# EAGLE design iSensor (EAGLE 5.10)

## Sheet 1 of 2
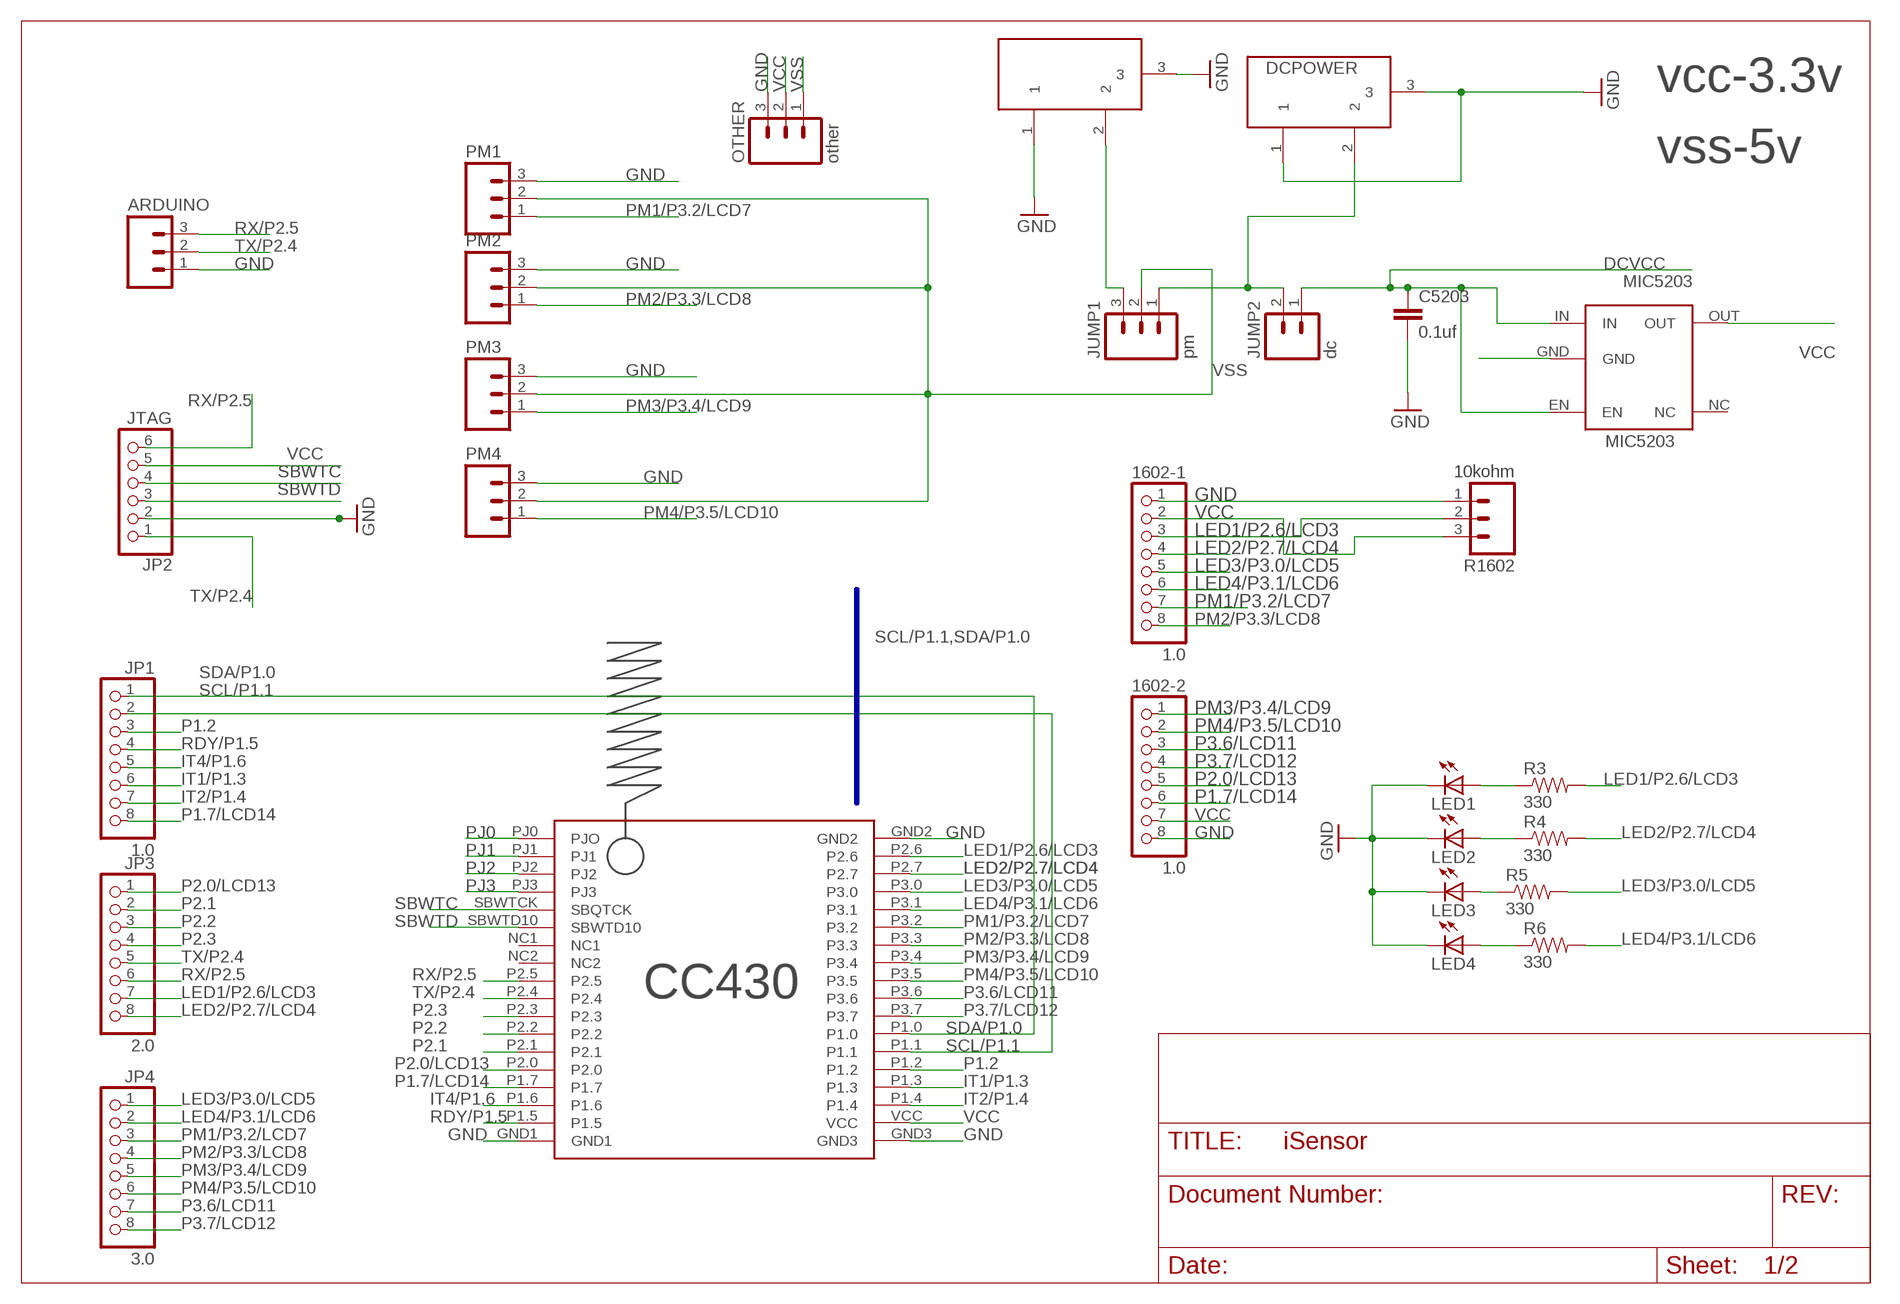
[diagram p0: schematic, sheet 1]

### Parts
1602-1  1.0  PINHEAD_PINHD-1X8  [PINHEAD_1X08]
1602-2  1.0  PINHEAD_PINHD-1X8  [PINHEAD_1X08]
ARDUINO  M03PTH  [1X03]
C5203  0.1uf  SPARKFUN_CAP1210  [SPARKFUN_1210]
DCPOWER  dcpower  POWERSUPPLY_DC21MMX  [POWERSUPPLY_DC-21MM]
JP1  1.0  PINHEAD_PINHD-1X8  [PINHEAD_1X08]
JP2  JTAG  PINHEAD_PINHD-1X6  [PINHEAD_1X06]
JP3  2.0  PINHEAD_PINHD-1X8  [PINHEAD_1X08]
JP4  3.0  PINHEAD_PINHD-1X8  [PINHEAD_1X08]
JUMP1  pm  M03LOCK  [1X03_LOCK]
JUMP2  dc  M02NG  [1X02]
LED1  SPARKFUN_LED5MM  [SPARKFUN_LED5MM]
LED2  SPARKFUN_LED5MM  [SPARKFUN_LED5MM]
LED3  SPARKFUN_LED5MM  [SPARKFUN_LED5MM]
LED4  SPARKFUN_LED5MM  [SPARKFUN_LED5MM]
MIC5203  MIC5203  RT8008  [RT8008]
OTHER  other  M03LOCK  [1X03_LOCK]
PM1  M03PTH  [1X03]
PM2  M03PTH  [1X03]
PM3  M03PTH  [1X03]
PM4  M03PTH  [1X03]
PMPOWER  pmpower  POWERSUPPLY_DC21MMX  [POWERSUPPLY_DC-21MM]
R3  330  SPARKFUN_RESISTOR  [SPARKFUN_0805]
R4  330  SPARKFUN_RESISTOR  [SPARKFUN_0805]
R5  330  SPARKFUN_RESISTOR  [SPARKFUN_0805]
R6  330  SPARKFUN_RESISTOR  [SPARKFUN_0805]
R1602  10kohm  M03LOCK  [1X03_LOCK]
U$1  CC430  [CC430]

### Nets
DCVCC: C5203.1 JUMP2.1 MIC5203.EN MIC5203.IN
GND: 1602-1.1 1602-2.8 ARDUINO.1 C5203.2 DCPOWER.1 DCPOWER.3 JP2.2 LED1.K(C) LED2.K(C) LED3.K(C) LED4.K(C) MIC5203.GND OTHER.3 PM1.3 PM2.3 PM3.3 PM4.3 PMPOWER.1 PMPOWER.3 R1602.1 U$1.GND1 U$1.GND2 U$1.GND3 ; also sheet 2
IT1/P1.3: JP1.6 U$1.P1.3 ; also sheet 2
IT2/P1.4: JP1.7 U$1.P1.4
IT4/P1.6: JP1.5 U$1.P1.6
LED1/P2.6/LCD3: 1602-1.3 JP3.7 R3.2 R1602.2 U$1.P2.6
LED2/P2.7/LCD4: 1602-1.4 JP3.8 R4.2 U$1.P2.7
LED3/P3.0/LCD5: 1602-1.5 JP4.1 R5.2 U$1.P3.0
LED4/P3.1/LCD6: 1602-1.6 JP4.2 R6.2 U$1.P3.1
N$1: DCPOWER.2 JUMP1.1 JUMP2.2
N$2: LED1.A R3.1
N$3: LED3.A R5.1
N$4: LED2.A R4.1
N$5: LED4.A R6.1
N$6: JUMP1.3 PMPOWER.2
P1.2: JP1.3 U$1.P1.2 ; also sheet 2
P1.7/LCD14: 1602-2.6 JP1.8 U$1.P1.7
P2.0/LCD13: 1602-2.5 JP3.1 U$1.P2.0
P2.1: JP3.2 U$1.P2.1 ; also sheet 2
P2.2: JP3.3 U$1.P2.2
P2.3: JP3.4 U$1.P2.3
P3.6/LCD11: 1602-2.3 JP4.7 U$1.P3.6
P3.7/LCD12: 1602-2.4 JP4.8 U$1.P3.7
PJ0: U$1.PJ0(PJO) ; also sheet 2
PJ1: U$1.PJ1 ; also sheet 2
PJ2: U$1.PJ2 ; also sheet 2
PJ3: U$1.PJ3 ; also sheet 2
PM1/P3.2/LCD7: 1602-1.7 JP4.3 PM1.1 U$1.P3.2
PM2/P3.3/LCD8: 1602-1.8 JP4.4 PM2.1 U$1.P3.3
PM3/P3.4/LCD9: 1602-2.1 JP4.5 PM3.1 U$1.P3.4
PM4/P3.5/LCD10: 1602-2.2 JP4.6 PM4.1 U$1.P3.5
RDY/P1.5: JP1.4 U$1.P1.5 ; also sheet 2
RX/P2.5: ARDUINO.3 JP2.6 JP3.6 U$1.P2.5
SBWTC: JP2.4 U$1.SBWTCK(SBQTCK)
SBWTD: JP2.3 U$1.SBWTD10
SCL/P1.1: JP1.2 U$1.P1.1 ; also sheet 2
SDA/P1.0: JP1.1 U$1.P1.0 ; also sheet 2
TX/P2.4: ARDUINO.2 JP2.1 JP3.5 U$1.P2.4
VCC: 1602-1.2 1602-2.7 JP2.5 MIC5203.OUT OTHER.2 R1602.3 U$1.VCC ; also sheet 2
VSS: JUMP1.2 OTHER.1 PM1.2 PM2.2 PM3.2 PM4.2
Unconnected: MIC5203.NC U$1.NC1 U$1.NC2

### Buses
SCL/P1.1,SDA/P1.0

### Notes on the sheet
- DCPOWER
- vcc-3.3v
- vss-5v

## Sheet 2 of 2
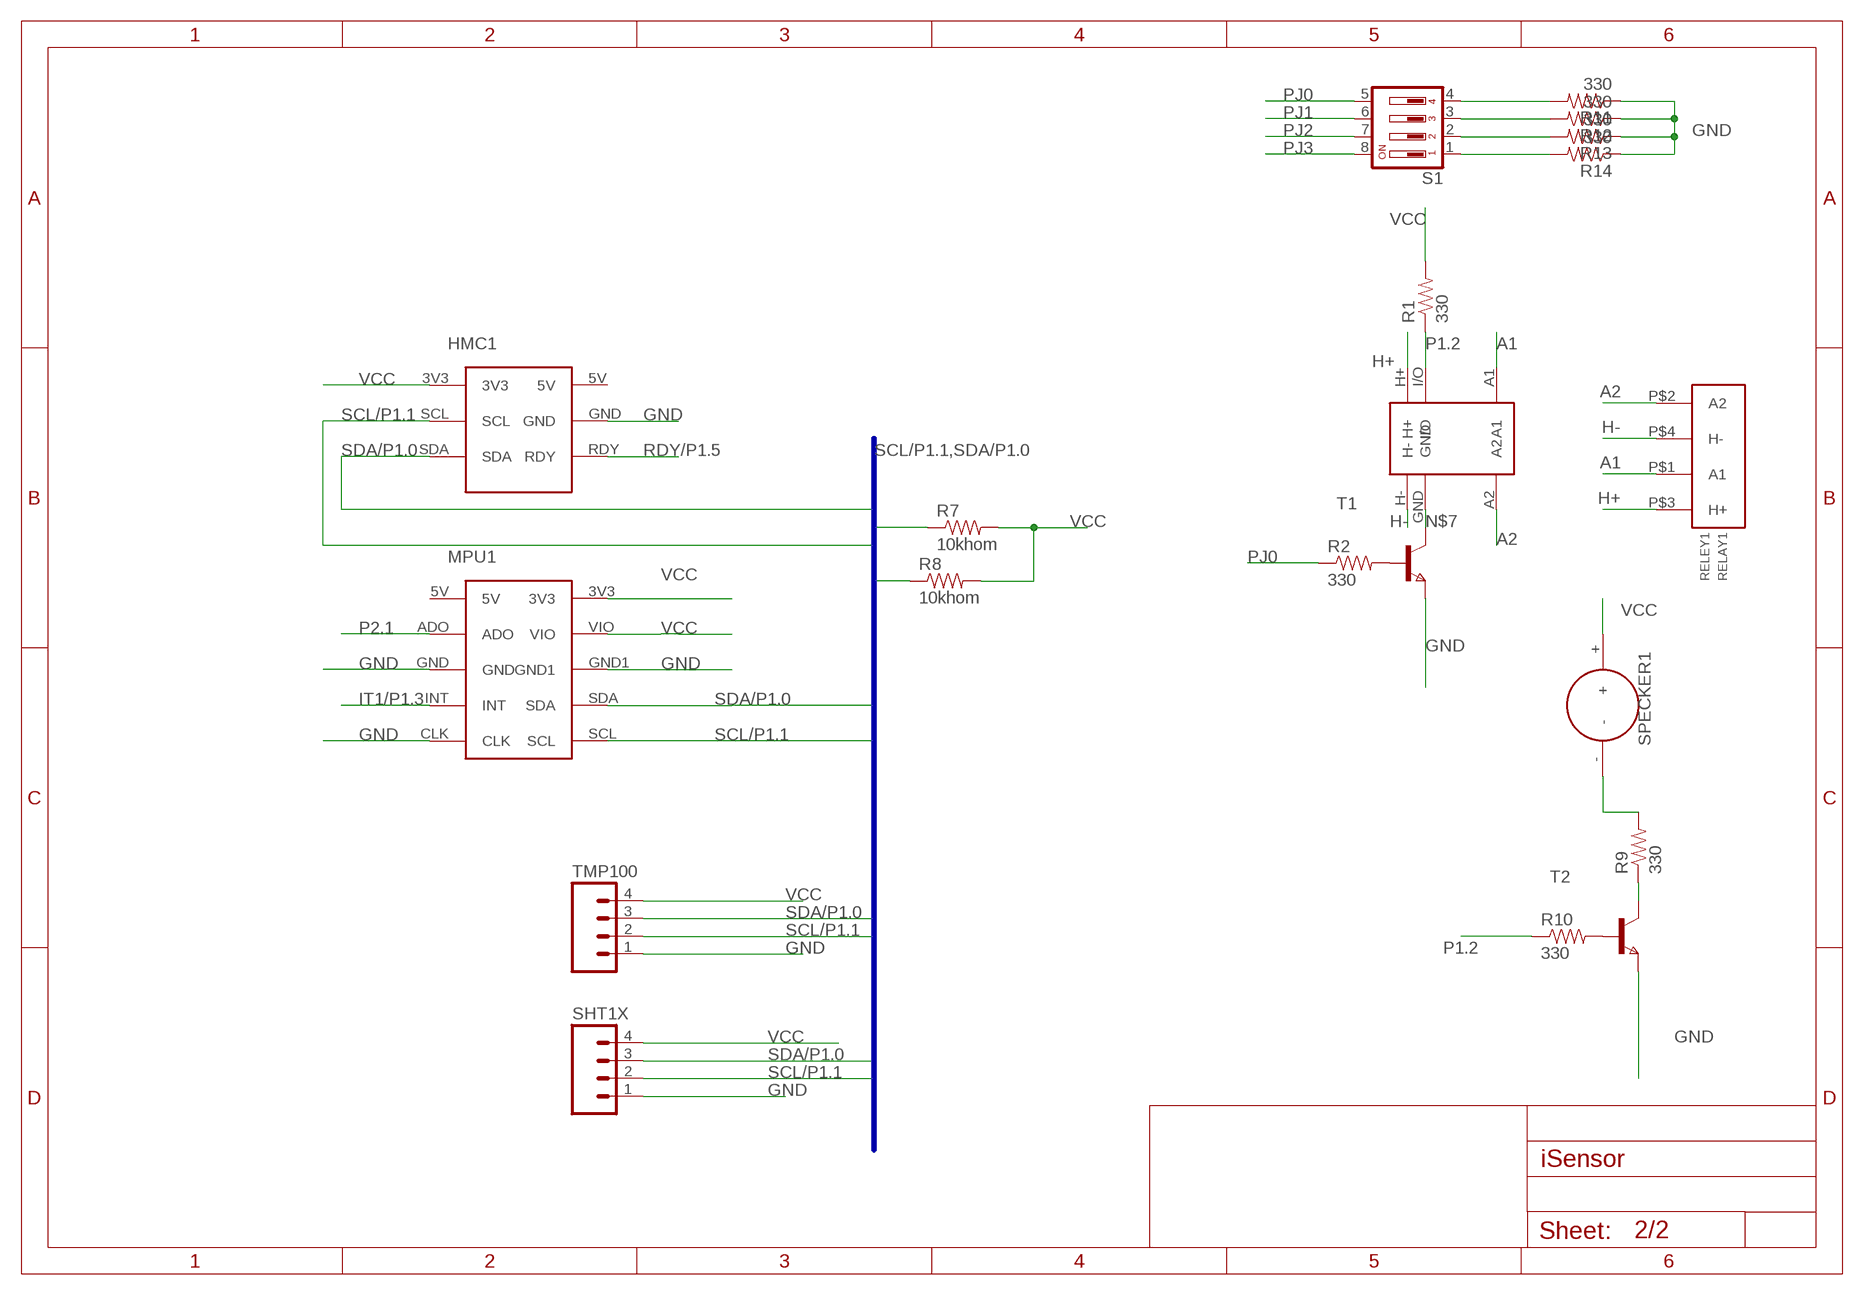
[diagram p1: schematic, sheet 2]

### Parts
HMC1  LSM303DLRHMC5883  [LSM303DLR]
MPU1  LSM303DLRMPU6050  [LSM303DLR]
R1  330  SPARKFUN_RESISTOR  [SPARKFUN_0805]
R2  330  SPARKFUN_RESISTOR  [SPARKFUN_0805]
R7  10khom  SPARKFUN_RESISTOR  [SPARKFUN_0805]
R8  10khom  SPARKFUN_RESISTOR  [SPARKFUN_0805]
R9  330  SPARKFUN_RESISTOR  [SPARKFUN_0805]
R10  330  SPARKFUN_RESISTOR  [SPARKFUN_0805]
R11  330  SPARKFUN_RESISTOR  [SPARKFUN_0805]
R12  330  SPARKFUN_RESISTOR  [SPARKFUN_0805]
R13  330  SPARKFUN_RESISTOR  [SPARKFUN_0805]
R14  330  SPARKFUN_RESISTOR  [SPARKFUN_0805]
RELER2  HRS1H-S-DC5V  [HRS1H-S-DC5V]
RELEY1  RELAY1  [RELAY1]
S1  DIP04YL  [DIP04YL]
SHT1X  SPARKFUN_M05  [SPARKFUN_1X05]
SPECKER1  SPECKER  [SPECKER]
T1  NPNSOT23  [SOT-23]
T2  NPNSOT23  [SOT-23]
TMP100  SPARKFUN_M05  [SPARKFUN_1X05]

### Nets
A1: RELER2.A1 RELEY1.P$1(A1)
A2: RELER2.A2 RELEY1.P$2(A2)
GND: HMC1.GND MPU1.CLK MPU1.GND MPU1.GND1 R11.1 R12.1 R13.1 R14.1 SHT1X.1 T1.2(E) T2.2(E) TMP100.1 ; also sheet 1
H+: RELER2.H+ RELEY1.P$3(H+)
H-: RELER2.H- RELEY1.P$4(H-)
IT1/P1.3: MPU1.INT ; also sheet 1
N$7: RELER2.GND T1.1(C)
N$8: R9.1 T2.1(C)
N$9: R2.2 T1.3(B)
N$10: R10.2 T2.3(B)
N$11: R9.2 SPECKER1.-
N$12: R11.2 S1.4
N$13: R12.2 S1.3
N$14: R13.2 S1.2
N$15: R14.2 S1.1
P1.2: R1.1 R10.1 RELER2.I/O ; also sheet 1
P2.1: MPU1.ADO ; also sheet 1
PJ0: R2.1 S1.5 ; also sheet 1
PJ1: S1.6 ; also sheet 1
PJ2: S1.7 ; also sheet 1
PJ3: S1.8 ; also sheet 1
RDY/P1.5: HMC1.RDY ; also sheet 1
SCL/P1.1: HMC1.SCL MPU1.SCL R7.1 SHT1X.2 TMP100.2 ; also sheet 1
SDA/P1.0: HMC1.SDA MPU1.SDA R8.1 SHT1X.3 TMP100.3 ; also sheet 1
VCC: HMC1.3V3 MPU1.3V3 MPU1.VIO R1.2 R7.2 R8.2 SHT1X.4 SPECKER1.+ TMP100.4 ; also sheet 1
Unconnected: HMC1.5V MPU1.5V

### Buses
SCL/P1.1,SDA/P1.0

## Library data of the parts
1602-1 1602-2 JP1 JP3 JP4 = arduno:PINHEAD_PINHD-1X8: PIN HEADER
ARDUINO JUMP1 OTHER PM1-PM4 R1602 = SparkFun:M03: Header 3 Standard 3-pin 0.1" header. Use with straight break away headers (SKU : PRT-00116), right angle break away headers (PRT-00553), swiss pins (PRT-00743), machine pins (PRT-00117), and female headers (PRT-00115). Molex polarized connector foot print use with SKU : PRT-08232 with associated crimp pins and housings.
C5203 = LSM303_breakout_board-v12:SPARKFUN_CAP: Capacitor Standard 0603 ceramic capacitor, and 0.1" leaded capacitor.
DCPOWER PMPOWER = arduno:POWERSUPPLY_DC21MM
HMC1 = HMC5883:LSM303DLR
JP2 = arduno:PINHEAD_PINHD-1X6: PIN HEADER
JUMP2 = SparkFun:M02NG
LED1-LED4 = ft232r:SPARKFUN_LED: LEDs Standard schematic elements and footprints for 5mm, 3mm, 1206, and 0603 sized LEDs. 5mm - Spark Fun Electronics SKU : COM-00529 (and others)
MIC5203 = mic5203-3.3:RT8008
MPU1 = MPU6050:LSM303DLR
R1-R14 = i2c:SPARKFUN_RESISTOR: Resistor Basic schematic elements and footprints for 0603, 1206, and PTH 1/10th watt (small) resistors.
RELER2 = reler1:HRS1H-S-DC5V
RELEY1 = RELAY1:RELAY1
S1 = switch-dil:DIP04YL: DIL/CODE SWITCH
SHT1X TMP100 = MCP4725_v12:SPARKFUN_M05: Header 5 Standard 5-pin 0.1" header. Use with straight break away headers (SKU : PRT-00116), right angle break away headers (PRT-00553), swiss pins (PRT-00743), machine pins (PRT-00117), and female headers (PRT-00115). Molex polarized connector foot print use with SKU : PRT-08230 with associated crimp pins and housings.
SPECKER1 = SPECKER:SPECKER
T1 T2 = zetex:NPNSOT23: NPN TRANSISTOR
U$1 = cc430:CC430: cc430

## Board
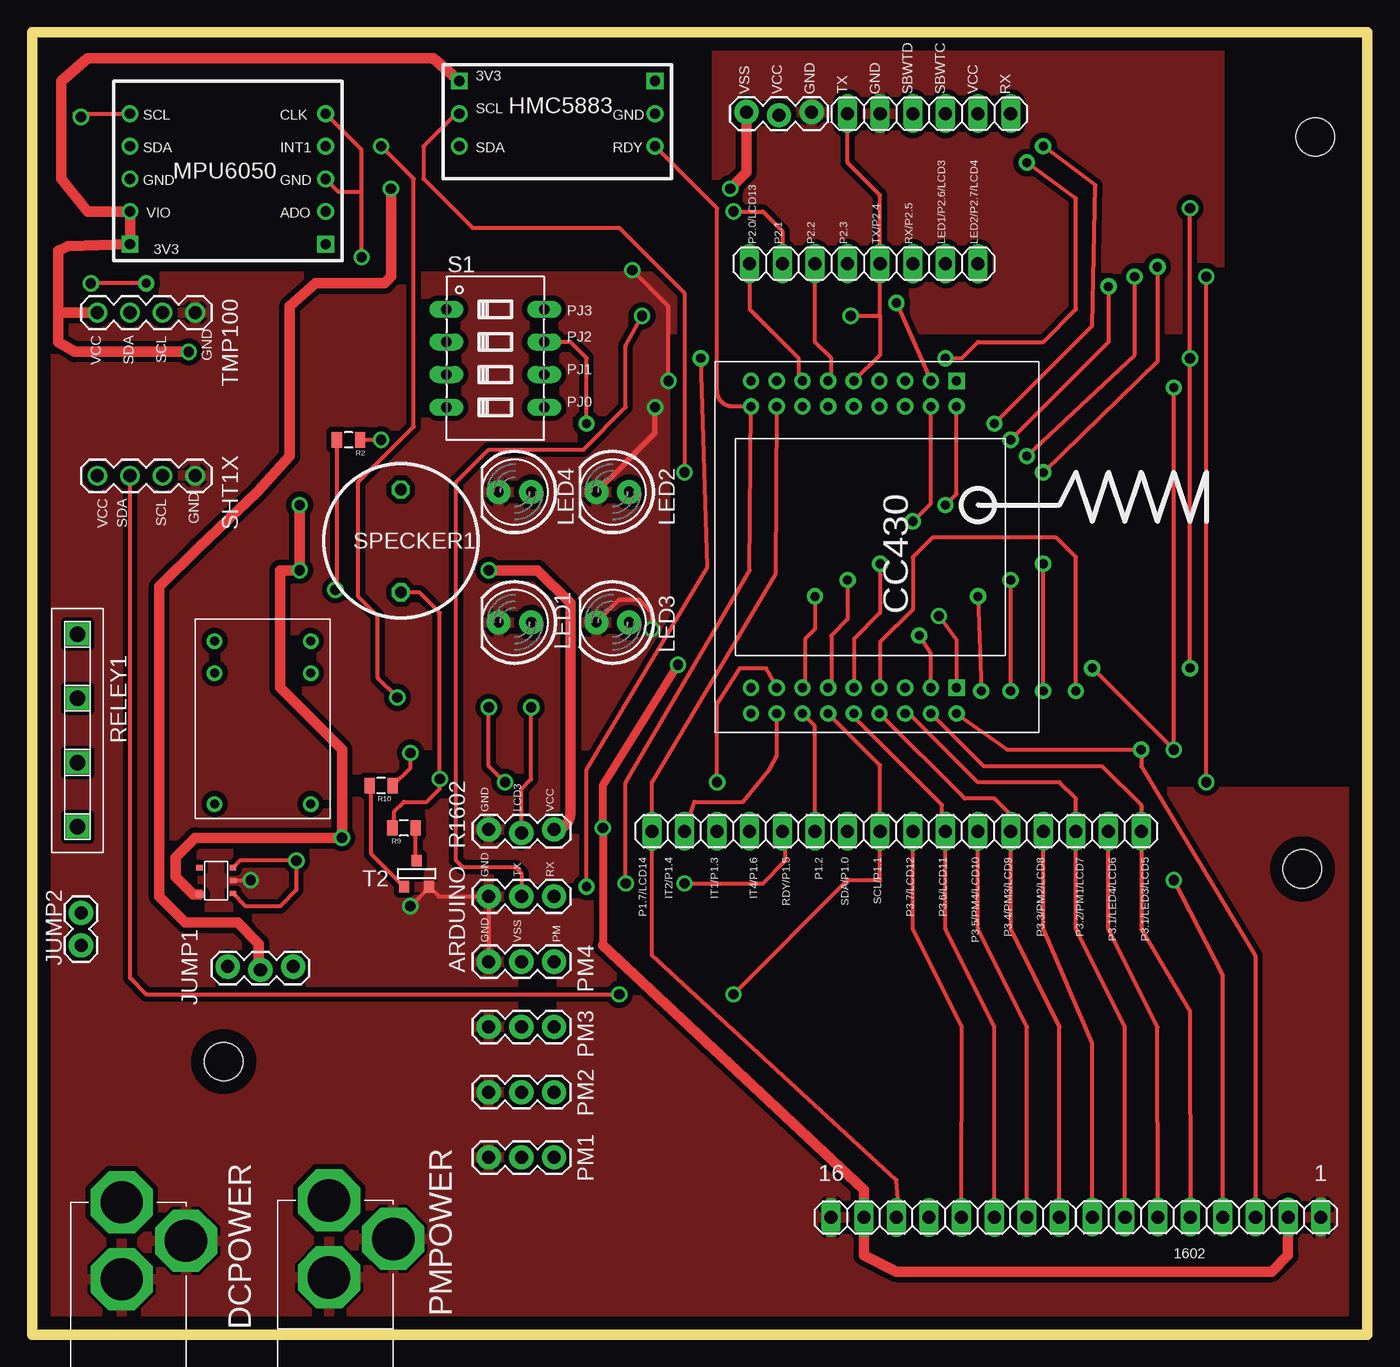
[diagram p2: board, top side]
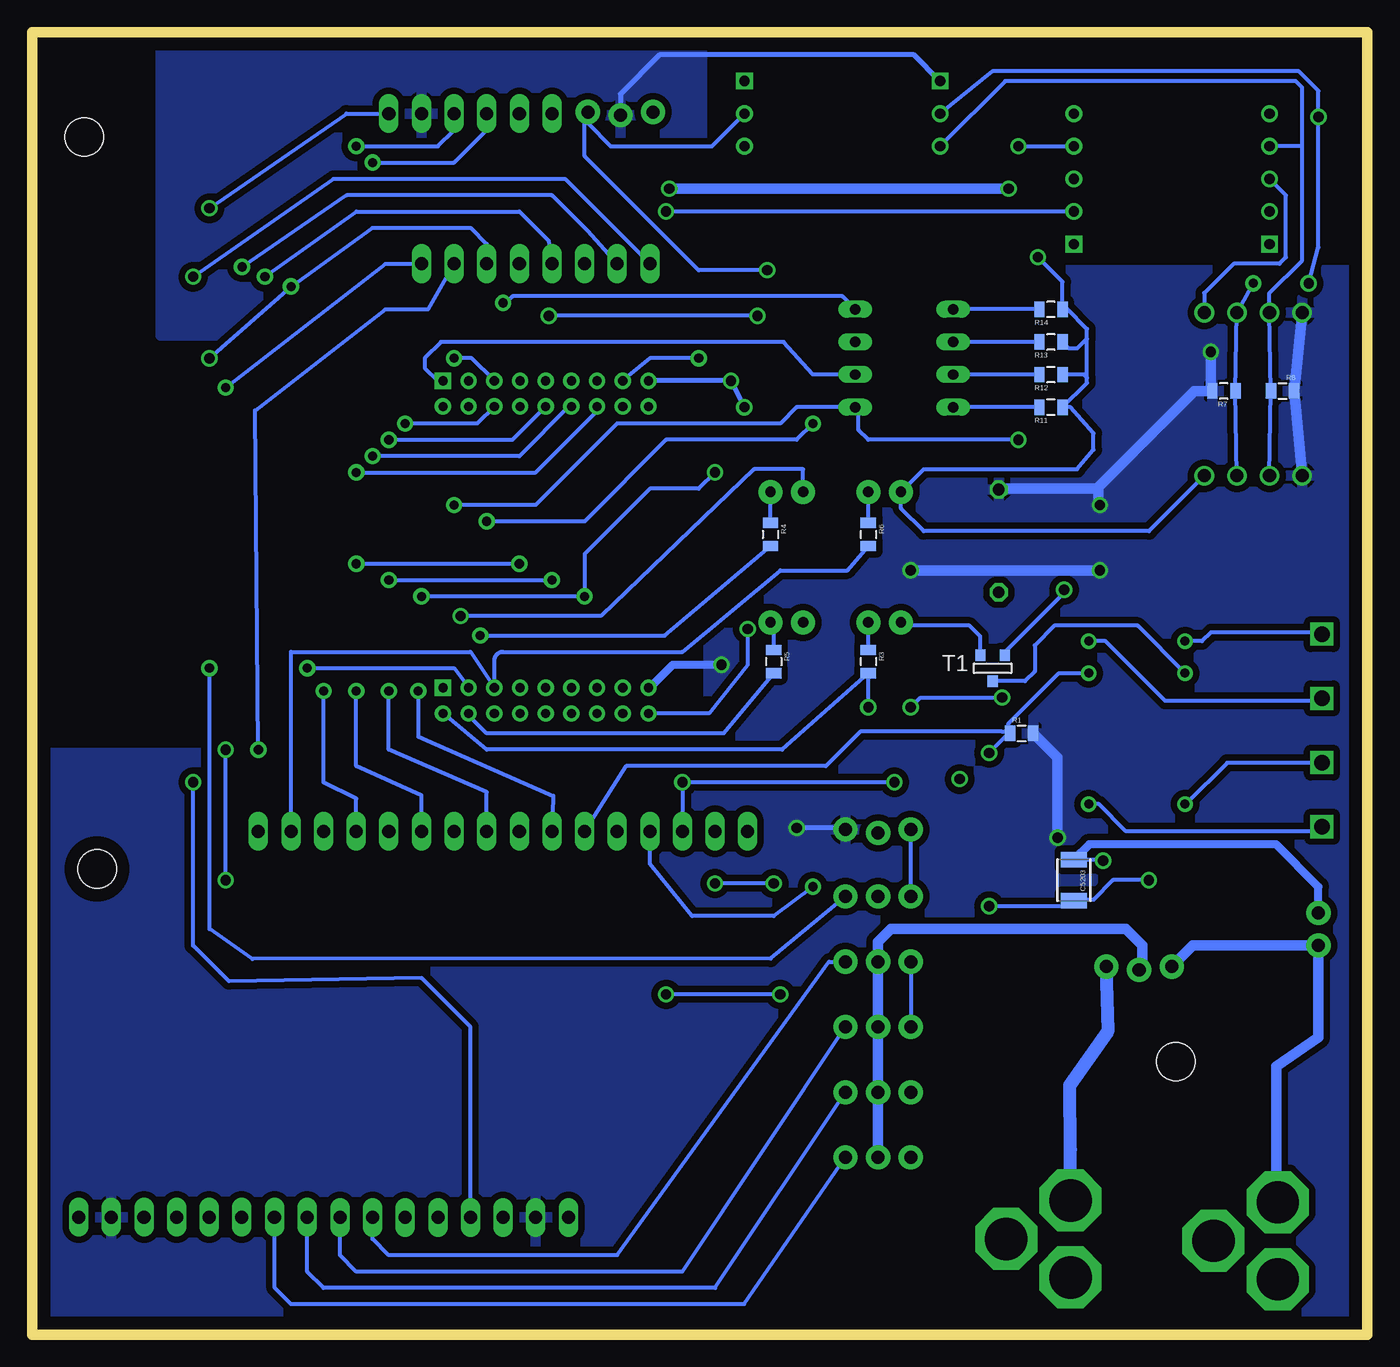
[diagram p3: board, bottom side, seen from below]

Size 103.98 x 101.44 mm. Coordinates in mm from the lower left corner, seen from the top.
Outline: 0,0 103.98,0 103.98,101.44 0,101.44 0,0
Copper layers (1*16): Top 0.035mm / dielectric 1.5mm / vcc 0.035mm
Design rules "default *": minimum track width 10mil, minimum drill 24mil, track to track 10mil, track to pad 10mil, pad to pad 10mil, via to via 10mil, smd to smd 10mil, copper to edge 40mil, drill to drill 8mil, minimum pad ring 10mil, minimum via ring 8mil, stop-mask expansion 4mil, vias tented up to drill 0mil, thermal gap 10mil
Holes 3 mm at 14.92,21.27 98.92,36.27 99.92,93.27

### Footprints (pad centres in the part's own frame; a part is rotated, then mirrored left to right if it is on the bottom)
PINHEAD_1X08 = drill 1.016 long: 1 -8.89,0; 2 -6.35,0; 3 -3.81,0; 4 -1.27,0; 5 1.27,0; 6 3.81,0; 7 6.35,0; 8 8.89,0
1X03 = drill 1.016 pad 1.88 round: 1 0,0; 2 2.54,0; 3 5.08,0
SPARKFUN_1210 = smd 1.2 x 2: 1 -1.6,0; 2 1.6,0
POWERSUPPLY_DC-21MM = drill 3.302 pad 4.826 octagon: 1 -5.08,-3.353; 2 -0.076,-6.35; 3 -0.076,-0.356
LSM303DLR = drill 0.8 pad 1.27 square: 3V3 1.27,12.7; 5V 16.51,12.7 | drill 0.8 pad 1.27 round: GND 16.51,10.16; RDY 16.51,7.62; SCL 1.27,10.16; SDA 1.27,7.62
PINHEAD_1X06 = drill 1.016 long: 1 -6.35,0; 2 -3.81,0; 3 -1.27,0; 4 1.27,0; 5 3.81,0; 6 6.35,0
1X03_LOCK = drill 1.016 pad 1.88 round: 1 0,0.127; 2 2.54,-0.127; 3 5.08,0.127
1X02 = drill 1.016 pad 1.88 round: 1 0,0; 2 2.54,0
SPARKFUN_LED5MM = drill 0.813 pad 1.88 round: A -1.27,0; K 1.27,0
RT8008 = smd 0.4 x 0.5: EN 2.5,-0.4; GND 1.5,-0.4; IN 0.5,-0.4; NC 2.5,2.2; OUT 0.4,2.2
LSM303DLR' = drill 0.8 pad 1.27 square: 3V3 16.51,12.7; 5V 1.27,12.7 | drill 0.8 pad 1.27 round: ADO 1.27,10.16; CLK 1.27,2.54; GND 1.27,7.62; GND1 16.51,7.62; INT 1.27,5.08; SCL 16.51,2.54; SDA 16.51,5.08; VIO 16.51,10.16
SPARKFUN_0805 = smd 0.8 x 1.2: 1 -0.9,0; 2 0.9,0
HRS1H-S-DC5V = drill 0.7 round: A1 14.4,9; A2 14.4,1.5; GND 4.2,1.5; H+ 1.7,9; H- 1.7,1.5; I/O 4.2,9
RELAY1 = drill 1.2 square: P$1 -6,-1; P$2 -1,-1; P$3 4,-1; P$4 9,-1
DIP04YL = drill 0.813 long: 1 -3.81,-3.81; 2 -1.27,-3.81; 3 1.27,-3.81; 4 3.81,-3.81; 5 3.81,3.81; 6 1.27,3.81; 7 -1.27,3.81; 8 -3.81,3.81
SPARKFUN_1X05 = drill 1.016 round: 1 0,0; 2 2.54,0; 3 5.08,0; 4 7.62,0
SPECKER = drill 0.9 octagon: + -4,0; - 4,0
SOT-23 = smd 0.787 x 0.889: 1 0.025,-1.016; 2 -0.94,1.016; 3 0.991,1.016
CC430 = drill 0.712 pad 1.27 round: GND1 1.5,-9.8; GND3 27.4,-9.8; NC1 1.5,0.2; NC2 3.5,0.2; P1.0 27.4,-3.8; P1.1 25.4,-5.8; P1.2 27.4,-5.8; P1.3 25.4,-7.8; P1.4 27.4,-7.8; P1.5 3.5,-9.8; P1.6 1.5,-7.8; P1.7 3.5,-7.8; P2.0 1.5,-5.8; P2.1 3.5,-5.8; P2.2 1.5,-3.8; P2.3 3.5,-3.8; P2.4 1.5,-1.8; P2.5 3.5,-1.8; P2.6 27.4,6.2; P2.7 25.4,4.2; P3.0 27.4,4.2; P3.1 25.4,2.2; P3.2 27.4,2.2; P3.3 25.4,0.2; P3.4 27.4,0.2; P3.5 25.4,-1.8; P3.6 27.4,-1.8; P3.7 25.4,-3.8; PJ0 3.5,6.2; PJ2 3.5,4.2; PJ3 1.5,4.2; SBWTCK 3.5,2.2; SBWTD10 1.5,2.2; VCC 25.4,-9.8 | drill 0.712 pad 1.27 square: GND2 25.4,6.2; PJ1 1.5,6.2

### Placement (x,y rotation side)
1602-1  91.46,9.16 180 top
1602-2  71.11,9.13 180 top
ARDUINO  35.56,34.13 0 top
C5203  22.86,35.4 270 bottom
DCPOWER  6.9,3.96 180 top
HMC1  32,84.93 0 top
JP1  57.15,39.21 180 top
JP2  69.85,95.09 0 top
JP3  64.77,83.41 0 top
JP4  77.47,39.21 180 top
JUMP1  15.24,28.54 0 top
JUMP2  3.81,32.86 270 top
LED1  37.59,55.47 180 top
LED2  45.21,65.63 180 top
LED3  45.21,55.47 180 top
LED4  37.59,65.63 180 top
MIC5203  15.24,33.88 90 top
MPU1  LSM303DLRMPU6050  [LSM303DLR']  24.13,97.63 180 top
OTHER  55.63,95.09 0 top
PM1  40.64,13.81 180 top
PM2  40.64,18.89 180 top
PM3  40.64,23.97 180 top
PM4  40.64,29.05 180 top
PMPOWER  23.05,4.11 180 top
R1  26.92,46.83 0 bottom
R2  24.64,69.69 180 top
R3  38.86,52.42 270 bottom
R4  46.48,62.32 270 bottom
R5  46.23,52.42 270 bottom
R6  38.86,62.32 270 bottom
R7  11.18,73.5 180 bottom
R8  6.6,73.5 0 bottom
R9  28.96,39.46 180 top
R10  27.18,42.77 180 top
R11  24.64,72.23 180 bottom
R12  24.64,74.77 180 bottom
R13  24.64,77.31 180 bottom
R14  24.64,79.85 180 bottom
R1602  35.56,39.21 0 top
RELER2  12.7,55.72 270 top
RELEY1  2.54,45.56 90 top
S1  36.07,76.04 270 top
SHT1X  12.7,66.9 180 top
SPECKER1  28.7,61.82 270 top
T1  29.21,51.91 0 bottom
T2  29.97,35.91 180 top
TMP100  12.7,79.6 180 top
U$1  65.79,75.79 270 top

### Tracks (layer width: path | path; a pad name or v marks a point on that pad's centre or on a via)
A1
  vcc 0.305: RELEY1.P$1 3.89,39.21 18.8,39.21 20.91,41.32 RELER2.A1
A2
  vcc 0.305: RELEY1.P$2 3.56,44.54 10.92,44.54 14.15,41.32 RELER2.A2
DCVCC  (via drill 0.8 pad 1.27)
  Top 0.305: MIC5203.EN 16.19,36.92 v20.57,36.92 20.57,34.64 19.3,33.37 16.65,33.37 MIC5203.IN
  vcc 0.305: C5203.1 20.65,37 v20.57,36.92
  vcc 0.61: JUMP2.1 3.81,34.89 7.11,38.19 21.67,38.19 C5203.1
GND  (via drill 0.8 pad 1.27)
  Top 0.305: MPU1.CLK 25.65,92.3 25.65,88.99 | v25.65,83.91 25.65,88.99 | MPU1.GND 23.88,88.99 25.65,88.99 | U$1.GND2 71.99,54.09 v70.61,55.97 | v29.46,33.37 30.91,34.82 T2.2 31.67,34.13 ARDUINO.1 PM4.3 | MIC5203.GND 16.23,35.38 v17.02,35.4 | v49.55,74.29 49.55,80.08 v46.74,82.9 | LED3.K 45.72,57.24 47.24,57.24 48.26,56.23 v48.26,54.96
  Top 0.406: LED2.K 48.51,70.2 v48.51,72.23
  vcc 0.305: v25.65,83.91 23.74,82 R14.1 23.37,79.85 21.84,78.33 21.84,77.56 | MPU1.GND1 6.35,88.74 6.35,83.91 6.86,83.41 10.41,83.41 12.7,81.12 TMP100.1 | v70.61,55.97 59.69,55.97 47.75,67.4 43.94,67.4 LED2.K | U$1.GND3 51.28,48.39 48.26,52.16 v48.26,54.96 | v29.46,33.37 23.29,33.37 C5203.2 22.78,33.88 21.34,33.88 19.81,35.4 v17.02,35.4 | T1.2 30.15,54.37 30.99,55.21 36.07,55.21 LED1.K | v46.74,82.9 52.07,82.9 60.96,91.79 60.96,94.96 OTHER.3 60.71,94.33 58.93,92.55 51.05,92.55 HMC1.GND | PM4.3 PM3.3 | 21.84,74.52 21.84,77.56 | 21.84,77.56 22.61,76.8 23.23,76.8 R13.1 | 21.84,74.52 21.84,74.12 R11.1 23.11,72.23 21.34,70.2 21.34,68.93 22.61,67.4 34.54,67.4 LED4.K 36.32,64.36 34.54,62.58 17.02,62.58 SHT1X.1 | 21.84,74.52 22.1,74.77 R12.1 | ARDUINO.1 R1602.1
  vcc 0.406: v48.51,72.23 v49.55,74.29 U$1.GND1
  pour Top (isolate 0.406): 0,82.39 53.34,82.39 53.34,101.19 92.46,101.19 92.46,78.33 49.28,78.33 49.28,42.26 103.98,42.26 103.8,0.03 0,0
H+
  vcc 0.305: RELEY1.P$3 3.73,49.37 15.75,49.37 20.4,54.02 RELER2.H+
H-
  vcc 0.305: RELEY1.P$4 3.68,54.7 12.19,54.7 12.88,54.02 RELER2.H-
IT1/P1.3  (via drill 0.8 pad 1.27)
  Top 0.305: U$1.P1.3 57.15,51.91 55.12,51.91 53.34,49.12 v53.34,43.02 | v28.45,49.62 26.92,51.15 26.92,55.97 25.4,57.5 25.4,66.39 29.72,70.71 29.72,90.01 v27.18,92.55 | v35.56,48.86 35.56,44.29 v36.83,43.02
  vcc 0.305: 53.34,42.51 JP1.6 | 53.34,42.51 v53.34,43.02 | v28.45,49.62 34.8,49.62 v35.56,48.86 | v36.83,43.02 52.83,43.02 53.34,42.51 | v27.18,92.55 MPU1.INT
IT2/P1.4
  Top 0.305: JP1.7 51.56,41.5 55.37,41.5 57.4,44.04 57.99,45.13 U$1.P1.4
IT4/P1.6  (via drill 0.71 pad 1.27)
  Top 0.305: v52.07,76.04 52.58,59.78 43.18,44.04 v43.18,34.89
  vcc 0.305: U$1.P1.6 55.88,76.04 v52.07,76.04 | v43.18,34.89 46.23,32.61 52.58,32.61 55.88,36.67 JP1.5
LED1/P2.6/LCD3  (via drill 0.71 pad 1.27, 0.8 pad 1.27)
  Top 0.305: v38.86,48.86 38.86,43.27 38.1,42.51 R1602.2 | 1602-1.3 95.25,29.56 86.36,44.29 v86.36,45.56 75.95,45.56 U$1.P2.6
  vcc 0.305: JP3.7 73.15,79.85 76.45,79.85 86.61,71.98 v86.36,45.56 | U$1.P2.6 71.66,48.13 68.58,45.56 45.58,45.56 R3.2 v38.86,48.86
LED2/P2.7/LCD4  (via drill 0.71 pad 1.27, 0.8 pad 1.27)
  Top 0.305: v82.55,51.91 v88.9,45.56 v88.9,73.75 | v69.09,54.45 69.99,53.04 U$1.P2.7 | v88.9,35.4 92.71,28.03 1602-1.4
  vcc 0.305: v82.55,51.91 71.12,51.91 U$1.P2.7 | JP3.8 76.45,83.41 v88.9,73.75 | R4.2 54.73,54.45 v69.09,54.45 | v88.9,35.4 v88.9,45.56
LED3/P3.0/LCD5
  Top 0.305: U$1.P3.0 74.08,44.29 83.31,44.29 86.36,41.24 JP4.1 86.36,31.59 90.17,25.24 1602-1.5
  vcc 0.305: R5.2 50.15,46.83 68.58,46.83 69.99,48.24 U$1.P3.0
LED4/P3.1/LCD6
  Top 0.305: JP4.2 83.82,31.59 87.63,23.97 1602-1.6
  vcc 0.305: JP4.2 83.82,53.18 69.85,53.18 68.29,50.84 U$1.P3.1 67.99,52.5 arc90 67.31,53.18 53.34,53.18 45.72,59.53 40.5,59.53 R6.2
N$1
  vcc 0.813: 3.89,30.32 13.59,30.32 JUMP1.1 | JUMP2.2 3.81,23.16 7.08,20.89 7.08,12.16 DCPOWER.2
  vcc 1.016: JUMP2.2 3.89,30.32
N$2
  vcc 0.305: R3.1 LED1.A
N$3
  vcc 0.305: LED3.A 46.23,55.21 R5.1
N$4
  vcc 0.305: R4.1 LED2.A
N$5
  vcc 0.305: R6.1 LED4.A
N$6
  vcc 1.016: JUMP1.3 20.18,23.67 23.18,19.44 23.12,14.44 PMPOWER.2
N$7
  vcc 0.305: RELER2.GND 17.89,55.21 24.38,55.21 25.91,53.69 25.91,51.66 26.67,50.89 T1.1
N$8
  Top 0.305: T2.1 29.86,37.02 R9.1
N$9  (via drill 0.8 pad 1.27)
  Top 0.305: R2.2 23.74,58.12 v23.62,58.01
  vcc 0.305: T1.3 28.22,53.16 23.62,57.75 v23.62,58.01
N$10
  Top 0.305: T2.3 28.96,34.89 26.42,37.43 26.42,42.63 R10.2
N$11  (via drill 0.8 pad 1.27)
  Top 0.305: SPECKER1.- 30.16,57.82 31.75,56.23 v31.75,43.27 31.75,42.51 30.73,41.5 28.96,41.5 28.19,40.73 28.19,39.6 R9.2
N$12
  vcc 0.305: R11.2 S1.4
N$13
  vcc 0.305: R12.2 S1.3
N$14
  vcc 0.305: R13.2 S1.2
N$15
  vcc 0.305: R14.2 S1.1
P1.2  (via drill 0.8 pad 1.27)
  Top 0.305: U$1.P1.2 60.96,47.41 JP1.3 | v29.46,45.31 29.46,44.15 R10.1
  vcc 0.305: JP1.3 57.73,44.29 42.16,44.29 39.49,46.97 28.45,46.97 28.43,46.95 27.94,46.95 | RELER2.I/O 24.01,51.52 27.94,47.59 27.94,46.95 | 27.94,46.95 R1.1 27.94,46.83 v29.46,45.31
P1.7/LCD14
  Top 0.305: U$1.P1.7 57.91,59.28 48.26,43.02 JP1.8 48.26,29.56 67.31,12.03 67.56,8.73 1602-2.6
P2.0/LCD13  (via drill 0.8 pad 1.27)
  Top 0.305: v91.44,43.02 v91.44,82.39 | JP3.1 55.88,79.85 59.69,76.04 59.69,74.58 U$1.P2.0
  vcc 0.305: v91.44,82.39 80.52,90.01 62.48,90.01 JP3.1 | v91.44,43.02 91.44,30.32 88.65,27.53 73.66,27.78 69.85,23.97 69.85,10 1602-2.5
P2.1  (via drill 0.71 pad 1.27, 0.8 pad 1.27)
  Top 0.305: v87.63,83.15 87.63,75.79 v78.74,67.15 | v54.61,87.47 56.9,87.47 58.42,85.95 JP3.2
  vcc 0.305: v87.63,83.15 79.5,88.74 63.5,88.74 60.71,85.95 JP3.2 58.42,83.66 | v78.74,67.15 64.77,67.15 59.69,72.23 59.93,72.23 U$1.P2.1 | MPU1.ADO v54.61,87.47
P2.2
  Top 0.305: JP3.3 60.96,77.31 62.23,76.04 62.23,74.53 U$1.P2.2
P2.3  (via drill 0.71 pad 1.27)
  Top 0.305: v85.85,82.39 85.85,76.29 v77.47,68.42
  vcc 0.305: JP3.4 63.75,85.18 66.04,87.47 78.74,87.47 v85.85,82.39 | v77.47,68.42 66.04,68.42 62.23,72.23 62.04,72.23 U$1.P2.3
P3.6/LCD11
  Top 0.305: U$1.P3.6 63.99,48.12 70.87,41.24 70.87,39.46 JP4.7 71.12,31.59 74.93,23.97 1602-2.3
P3.7/LCD12  (via drill 0.71 pad 1.27)
  Top 0.305: v76.2,50.13 v76.2,58.77 | v63.5,58.77 63.5,55.72 62.23,54.45 62.23,50.63 U$1.P3.7 | JP4.8 68.58,31.59 72.39,23.97 1602-2.4
  vcc 0.305: JP4.8 68.58,42.26 76.2,45.56 v76.2,50.13 | v76.2,58.77 v63.5,58.77
PJ0  (via drill 0.71 pad 1.27, 0.8 pad 1.27)
  Top 0.305: U$1.PJ0 71.99,65.48 v71.12,64.61 | R2.1 v27.18,69.69
  vcc 0.305: v71.12,64.61 64.77,64.61 58.42,70.96 45.72,70.96 44.45,72.23 S1.5 39.62,72.23 39.62,70.45 38.86,69.69 v27.18,69.69
PJ1
  vcc 0.305: S1.6 43.18,74.77 45.47,77.31 72.14,77.31 73.41,76.04 73.41,75.28 72.41,74.29 U$1.PJ1
PJ2  (via drill 0.71 pad 1.27)
  Top 0.305: U$1.PJ2 69.99,64.75 v68.58,63.34 | v43.18,70.96 43.18,76.04 41.91,77.31 S1.7
  vcc 0.305: v68.58,63.34 60.96,63.34 54.61,69.69 44.45,69.69 v43.18,70.96
PJ3  (via drill 0.71 pad 1.27)
  Top 0.305: v67.31,80.36 U$1.PJ3
  vcc 0.305: S1.8 40.89,80.87 66.55,80.87 67.06,80.36 v67.31,80.36
PM1/P3.2/LCD7
  Top 0.305: U$1.P3.2 68.29,48.39 73.66,43.02 80.01,43.02 81.28,41.75 JP4.3 81.28,31.59 85.09,23.97 1602-1.7
  vcc 0.305: PM1.1 48.53,2.38 83.82,2.38 85.09,3.65 1602-1.7
PM2/P3.3/LCD8  (via drill 0.71 pad 1.27)
  Top 0.305: U$1.P3.3 66.04,50.44 66.04,53.94 68.58,56.48 68.58,60.55 70.1,62.07 79.76,62.07 81.28,60.55 v81.28,50.13 | JP4.4 78.74,31.59 82.55,22.7 1602-1.8
  vcc 0.305: JP4.4 78.74,41.75 81.28,43.02 v81.28,50.13 | PM2.1 50.8,3.65 81.28,3.65 82.55,4.92 1602-1.8
PM3/P3.4/LCD9
  Top 0.305: U$1.P3.4 72.62,41.75 74.93,41.75 76.2,40.48 JP4.5 76.2,31.59 80.01,23.97 1602-2.1
  vcc 0.305: PM3.1 53.34,4.92 78.74,4.92 80.01,6.19 80.01,8.73 1602-2.1
PM4/P3.5/LCD10  (via drill 0.71 pad 1.27)
  Top 0.305: v78.74,50.13 v78.74,60.04 | v66.04,60.04 66.04,56.23 64.01,54.2 64.01,50.41 U$1.P3.5 | JP4.6 73.66,31.59 77.47,23.97 1602-2.2
  vcc 0.305: JP4.6 73.66,42 78.74,44.29 v78.74,50.13 | v78.74,60.04 v66.04,60.04 | PM4.1 41.91,29.05 58.42,6.19 76.2,6.19 77.47,7.46 1602-2.2
RDY/P1.5  (via drill 0.8 pad 1.27)
  Top 0.305: HMC1.RDY 53.34,87.72 53.34,73.5 arc90 54.55,72.29 U$1.P1.5 55.88,59.53 46.23,43.02 v46.23,35.15 | v50.8,35.15 56.9,35.15 58.67,36.92 58.67,38.96 JP1.4
  vcc 0.305: v46.23,35.15 v50.8,35.15
RX/P2.5  (via drill 0.71 pad 1.27, 0.8 pad 1.27)
  Top 0.305: v83.82,81.63 83.82,77.31 v76.2,69.69 | v90.17,51.91 v90.17,76.04 v90.17,87.72
  vcc 0.305: v76.2,69.69 66.58,69.69 U$1.P2.5 | ARDUINO.3 46.48,29.3 86.83,29.25 90.17,31.59 v90.17,51.91 | JP3.6 68.58,84.93 69.85,86.2 77.47,86.2 v83.82,81.63 v90.17,76.04 | JP2.6 79.5,95.09 v90.17,87.72
SBWTC  (via drill 0.71 pad 1.27)
  Top 0.305: v78.74,92.55 82.8,89.5 82.55,78.58 v74.93,70.96
  vcc 0.305: JP2.4 71.12,93.82 72.39,92.55 v78.74,92.55 | v74.93,70.96 69.31,70.96 U$1.SBWTCK
SBWTD  (via drill 0.71 pad 1.27)
  Top 0.305: v77.47,91.28 81.28,88.49 81.28,79.85 78.74,77.31 73.66,77.31 72.39,76.04 v71.12,76.04
  vcc 0.305: JP2.3 68.58,93.82 71.12,91.28 v77.47,91.28 | v71.12,76.04 69.74,76.04 U$1.SBWTD10
SCL/P1.1  (via drill 0.71 pad 1.27, 0.8 pad 1.27)
  Top 0.305: v73.66,57.5 v73.91,50.13 | v50.8,67.15 50.8,81.12 45.72,86.2 34.29,86.2 30.48,90.01 30.48,92.55 33.02,95.09 HMC1.SCL | v60.96,57.5 60.96,54.96 60.2,54.2 60.2,50.6 U$1.P1.1 | v3.81,94.84 3.3,95.09 MPU1.SCL | v8.89,81.88 v4.57,81.88
  vcc 0.305: JP1.2 63.4,41.96 73.91,46.58 v73.91,50.13 | v73.66,57.5 v60.96,57.5 60.96,60.8 55.88,65.88 52.07,65.88 v50.8,67.15 | SHT1X.2 R7.1 TMP100.2 v8.89,81.88 | v4.57,81.88 3.81,84.68 v3.81,94.84 3.81,96.87 5.33,98.39 29.21,98.39 HMC1.SCL
SDA/P1.0  (via drill 0.8 pad 1.27)
  Top 0.305: v54.61,26.51 63.5,35.4 66.04,35.4 JP1.1 66.04,44.33 U$1.P1.0 | v45.72,26.51 8.89,26.51 7.62,27.78 SHT1X.3
  vcc 0.305: SHT1X.3 R8.1 TMP100.3 7.62,81.12 5.08,83.66 5.08,92.55 | HMC1.SDA 28.19,97.63 5.59,97.63 5.08,97.12 5.08,92.55 | v45.72,26.51 v54.61,26.51 | 5.08,92.55 MPU1.SDA
TX/P2.4  (via drill 0.8 pad 1.27)
  Top 0.305: JP2.1 63.5,91.28 66.04,88.74 JP3.5 66.04,79.34 | U$1.P2.4 66.04,76.29 66.04,79.34 | v47.5,79.34 46.23,77.06 46.23,72.23 42.93,68.93 35.56,68.93 33.02,66.39 33.02,36.92 33.53,36.42 37.59,36.42 38.1,35.91 ARDUINO.2 | v63.75,79.34 66.04,79.34
  vcc 0.305: v47.5,79.34 v63.75,79.34
VCC  (via drill 0.8 pad 1.27)
  Top 0.61: v50.29,52.16 44.45,42.77 v44.45,39.46 44.45,30.32
  Top 0.813: HMC1.3V3 31.24,99.41 4.32,99.41 2.29,97.63 2.29,90.01 4.32,87.47 MPU1.VIO MPU1.3V3 2.79,84.78 2.03,84.42 2.03,79.6 | 2.03,79.6 2.03,77.31 3.3,76.55 v12.19,76.55 | 2.03,79.6 TMP100.4 | R1602.3 arc90 41.91,40.61 41.91,56.99 39.37,59.53 v35.56,59.53 | v20.83,64.61 v20.83,59.53 19.3,59.53 19.3,50.39 24.13,45.56 v24.13,38.7 12.7,38.7 11.18,37.18 11.18,35.65 12.55,34.28 MIC5203.OUT | 1602-1.2 97.79,6.19 96.52,4.92 67.31,4.92 64.77,6.19 1602-2.7 64.77,11.27 44.45,30.32
  vcc 0.305: R7.2 12.19,73.62 | 28.64,65.88 SPECKER1.+
  vcc 0.406: HMC1.3V3 35.31,99.66 55.12,99.66 58.17,96.61 OTHER.2 | v44.45,39.46 40.64,39.46 R1602.3
  vcc 0.61: v50.29,52.16 54.1,52.16 55.88,50.39 U$1.VCC
  vcc 0.813: SHT1X.4 R8.2 TMP100.4 | v20.83,59.53 v35.56,59.53 | 28.64,65.88 21.08,65.88 20.96,66.01 | 20.96,66.01 13.46,73.5 R7.2 | v20.83,64.61 20.96,64.74 20.96,66.01 | 12.19,73.62 v12.19,76.55 | R1.2 24.13,44.94 v24.13,38.7
  pour vcc (isolate 0.508): 51.82,82.9 51.82,101.69 93.98,101.69 93.98,77.82 51.31,77.82 51.31,45.31 103.98,45.31 103.47,0.25 0,-0.51 0,82.9
VSS  (via drill 0.8 pad 1.27)
  Top 0.813: OTHER.1 55.63,90.52 v54.36,89.25 | v27.94,89.25 27.94,82.39 27.43,81.88 22.1,81.88 20.07,80.1 20.07,68.42 17.53,65.63 12.95,61.31 9.91,58.26 9.91,34.13 11.94,32.1 16,32.1 17.65,30.45 17.65,28.54 JUMP1.2
  vcc 0.813: v27.94,89.25 v54.36,89.25 | PM1.2 PM2.2 PM3.2 PM4.2 38.1,30.57 37.08,31.59 18.8,31.59 17.53,30.32 17.53,28.67 JUMP1.2

### Text on the board
tPlace: VSS | VCC | GND | TX | GND | SBWTD | SBWTC | VCC | RX | SCL | SCL | CLK | GND | SDA | INT1 | SDA | RDY | GND | GND | VIO | ADO | P2.0/LCD13 | P2.1 | P2.2 | P2.3 | TX/P2.4 | RX/P2.5 | LED1/P2.6/LCD3 | LED2/P2.7/LCD4 | PJ3 | VCC | SDA | SCL | GND | PJ2 | PJ1 | PJ0 | VCC | SDA | SCL | GND | GND | LCD3 | VCC | P1.7/LCD14 | IT2/P1.4 | IT1/P1.3 | IT4/P1.6 | RDY/P1.5 | P1.2 | SDA/P1.0 | SCL/P1.1 | P3.7/LCD12 | P3.6/LCD11 | P3.5/PM4/LCD10 | P3.4/PM3/LCD9 | P3.3/PM2/LCD8 | P3.2/PM1/LCD7 | P3.1/LED4/LCD6 | P3.1/LED3/LCD5 | GND | TX | RX | GND | VSS | PM | 16 | 1 | 1602